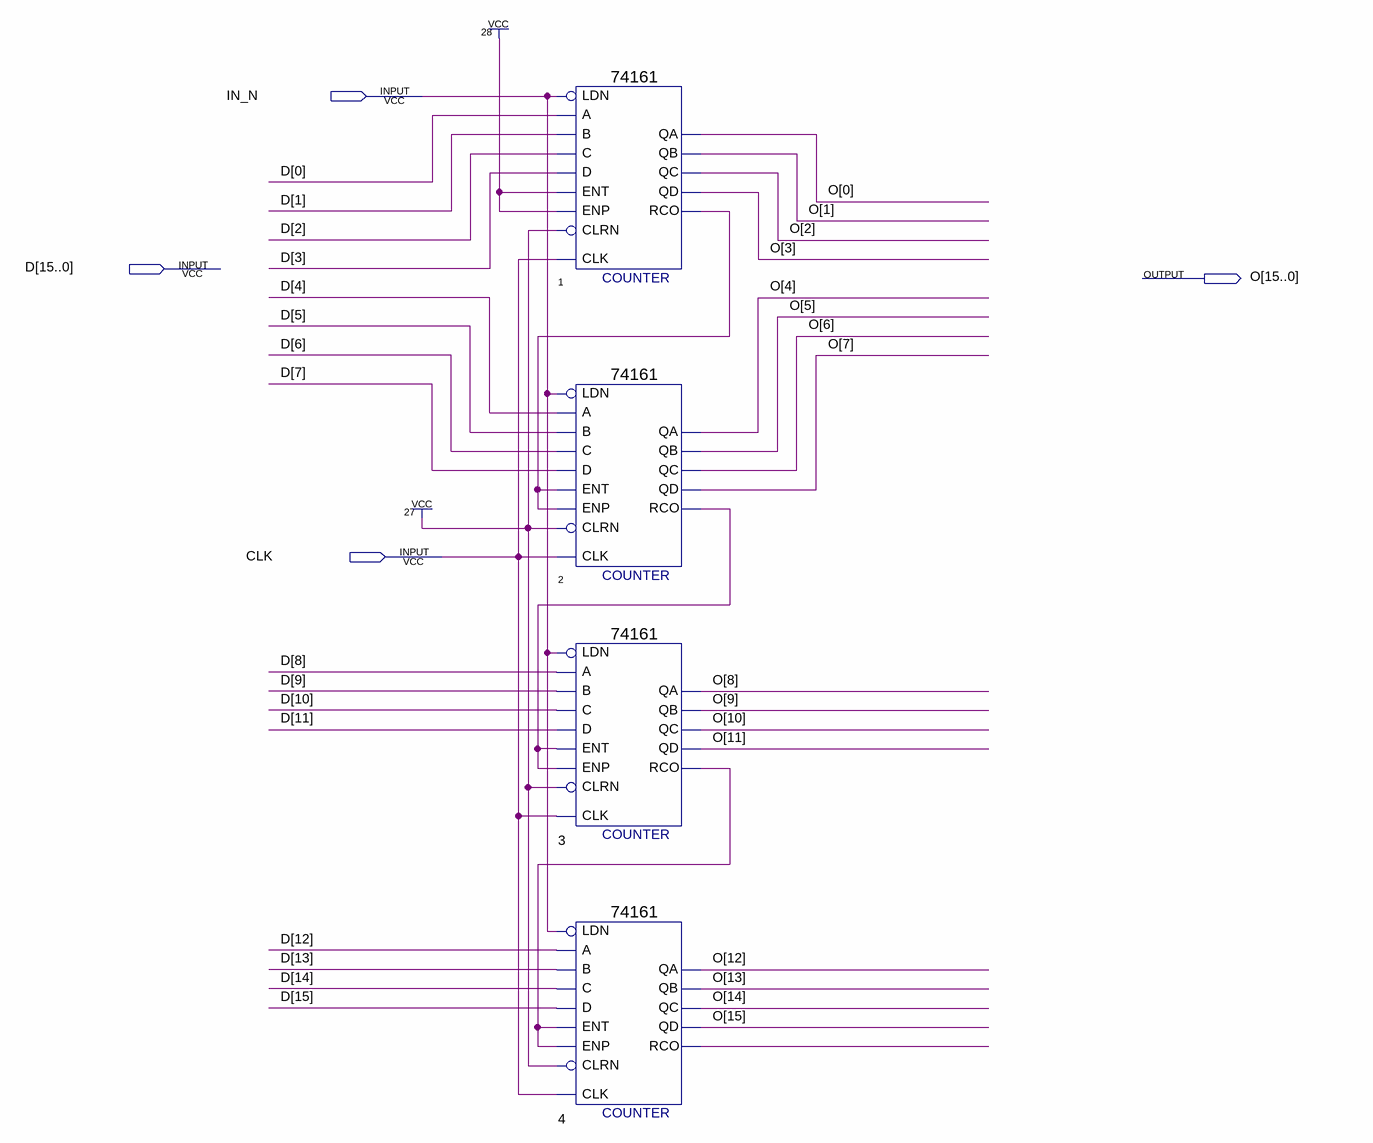
[diagram p0: schematic sheet]
// Quartus schematic PC_16bit.bdf as structural Verilog: 4 symbols, 4 pins
module PC_16bit (
  input  IN_N,
  input  [15:0] D,
  input  CLK,
  output [15:0] O
);

  wire n1_rco, n2_rco, n3_rco, n4_rco;

  \74161  u_1 (
    .LDN(IN_N), .A(D[0]), .ENT(1'b1), .D(D[3]), .C(D[2]), .B(D[1]), .CLRN(1'b1), .CLK(CLK), .ENP(1'b1),
    .QD(O[3]), .QC(O[2]), .QB(O[1]), .QA(O[0]), .RCO(n1_rco));
  \74161  u_2 (
    .LDN(IN_N), .A(D[4]), .ENT(n1_rco), .D(D[7]), .C(D[6]), .B(D[5]), .CLRN(1'b1), .CLK(CLK), .ENP(n1_rco),
    .QD(O[7]), .QC(O[6]), .QB(O[5]), .QA(O[4]), .RCO(n2_rco));
  \74161  u_3 (
    .LDN(IN_N), .A(D[8]), .ENT(n2_rco), .D(D[11]), .C(D[10]), .B(D[9]), .CLRN(1'b1), .CLK(CLK), .ENP(n2_rco),
    .QD(O[11]), .QC(O[10]), .QB(O[9]), .QA(O[8]), .RCO(n3_rco));
  \74161  u_4 (
    .LDN(IN_N), .A(D[12]), .ENT(n3_rco), .D(D[15]), .C(D[14]), .B(D[13]), .CLRN(1'b1), .CLK(CLK),
    .ENP(n3_rco), .QD(O[15]), .QC(O[14]), .QB(O[13]), .QA(O[12]), .RCO(n4_rco));
endmodule
